# EAGLE design ADSR_duino (EAGLE 9.2.2)
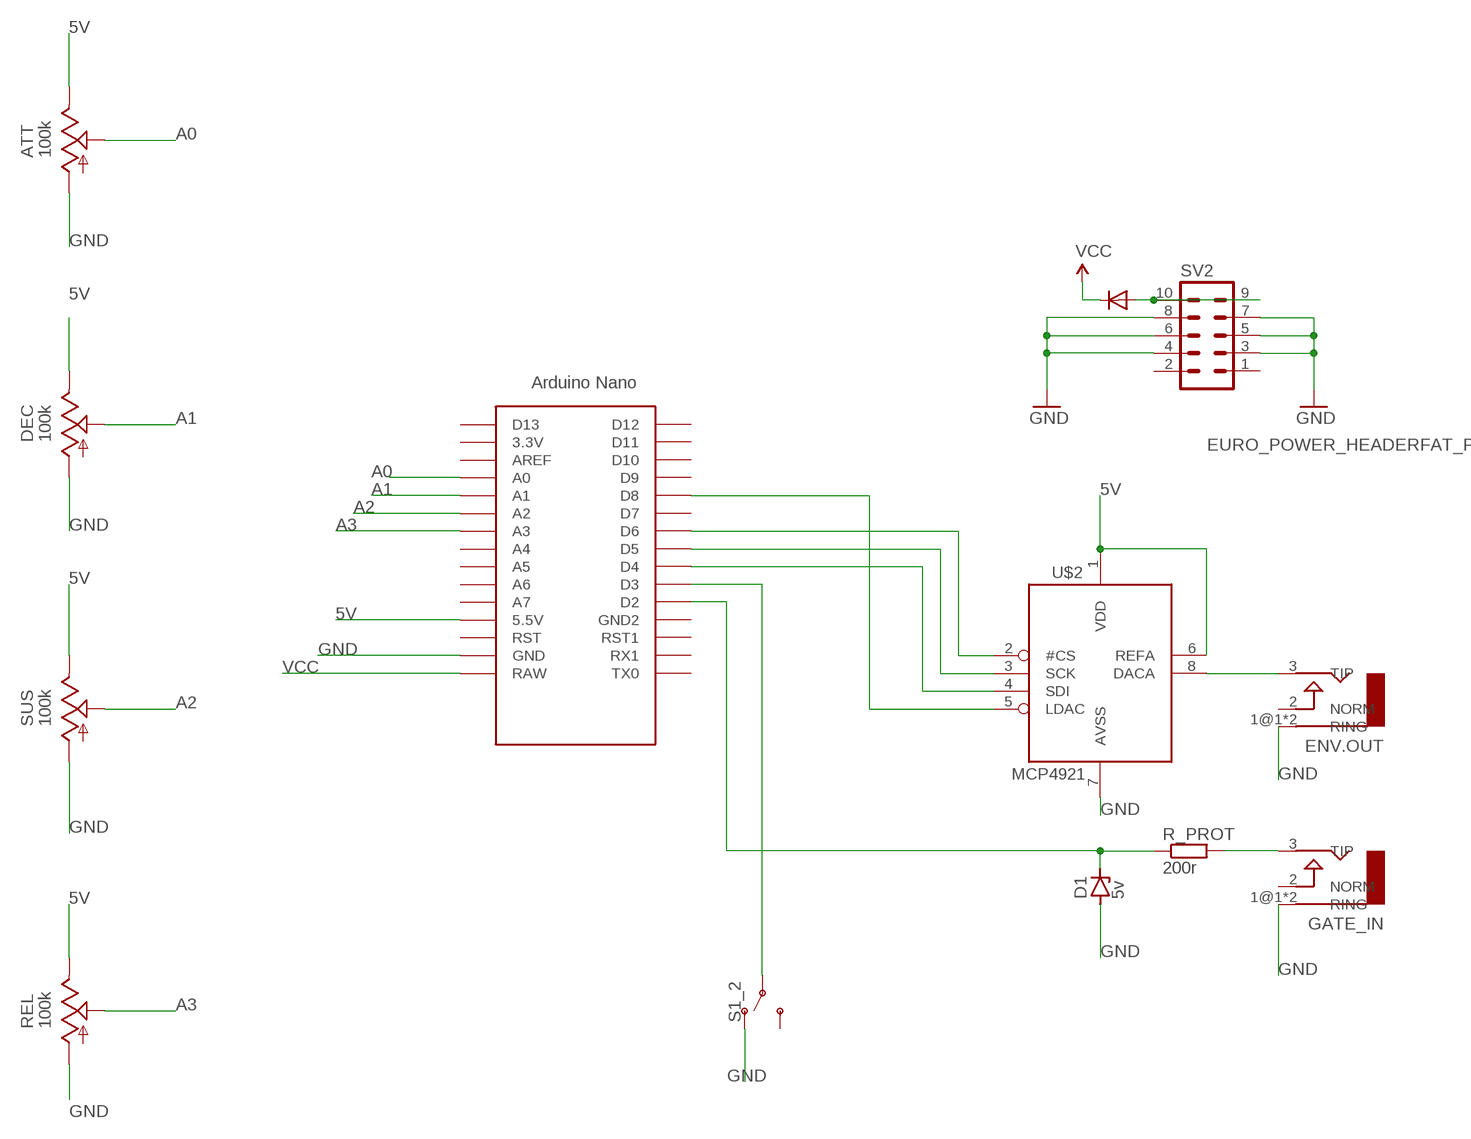
[diagram p0: schematic, sheet 1]

## Parts
ATT  100k  TRIMSLIDE45  [SLIDEPOT-45]
D1  5v  ZENER-DIODEZD-5  [ZDIO-5]
D2  1N5819HW  DIODEDO-1N4148  [DO-1N4148]
DEC  100k  TRIMSLIDE45  [SLIDEPOT-45]
ENV.OUT  AUDIO-JACKERTHENVAR  [ERTHENVAR-JACK]
GATE_IN  AUDIO-JACKERTHENVAR  [ERTHENVAR-JACK]
R_PROT  200r  RESISTOR7MM  [7MM_RESISTOR]
REL  100k  TRIMSLIDE45  [SLIDEPOT-45]
S1_2  SWITCH-SPDT-PTH-11.6X4.0MM  [SWITCH_SPDT_PTH_11.6X4.0MM]
SUS  100k  TRIMSLIDE45  [SLIDEPOT-45]
SV2  EURO_POWER_HEADERFAT_PADS  [EURO_PWR_HEADER_FAT]
U$1  NANO  [NANO]
U$2  MCP4921  [DIL08]

## Nets
5V: ATT.B DEC.B REL.B SUS.B U$1.5V(5.5V) U$2.1(VDD) U$2.6(REFA)
A0: ATT.WIPER U$1.A0
A1: DEC.WIPER U$1.A1
A2: SUS.WIPER U$1.A2
A3: REL.WIPER U$1.A3
GND: ATT.A D1.A DEC.A ENV.OUT.1@1(RING) ENV.OUT.1@2(RING) GATE_IN.1@1(RING) GATE_IN.1@2(RING) REL.A S1_2.1(O) SUS.A SV2.3 SV2.4 SV2.5 SV2.6 SV2.7 SV2.8 U$1.GND U$2.7(AVSS)
N$1: D2.A SV2.9 SV2.10
N$2: S1_2.2(P) U$1.D3
N$3: GATE_IN.3(TIP) R_PROT.2
N$4: ENV.OUT.3(TIP) U$2.8(DACA)
N$5: D1.C R_PROT.1 U$1.D2
N$6: U$1.D4 U$2.4(SDI)
N$7: U$1.D5 U$2.3(SCK)
N$8: U$1.D6 U$2.2(#CS)
N$9: U$1.D8 U$2.5(LDAC)
VCC: D2.C U$1.RAW
Unconnected: ENV.OUT.2(NORM) GATE_IN.2(NORM) S1_2.3(S) SV2.1 SV2.2 U$1.3.3V U$1.A4 U$1.A5 U$1.A6 U$1.A7 U$1.AREF U$1.D7 U$1.D9 U$1.D10 U$1.D11 U$1.D12 U$1.D13 U$1.GND1(GND2) U$1.RST U$1.RST1 U$1.RX1 U$1.TX0

## Library data of the parts
ATT DEC REL SUS = stefan-lochbrunner_EAGLE_master_custom libraries_potentiometers_Bourns PTA series_Bourns PTA series:TRIM: Sliding potentiometers Based on Adafruits (https://github.com/adafruit/Adafruit-Eagle-Library) 'TRIM' device. For Bourns PTA series and TT Electronics PSxx series potentiometers.
D1 = diode:ZENER-DIODE: Z-Diode
D2 = adafruit:DIODE: Diode SMADIODE - SMA Surface Mount Package 20V 1A Schottky Diode Digikey: 641-1014-6-ND DO-1N4148 - Through Hole Small Current Diode SOD-123 20V 1 A (.5mV Vf) Schottky Diode - Digikey: MBRX120TPMSCT-ND SOD-323 10V 570mA (.38mV Vf, 3ns) Schottky Diode - Digikey: ZLLS410CT-ND SOD-523 30V 30mA Schottky Diode (RB751S-40TE61) - Digikey: RB751S-40TE61CT-ND SOT23-R/W - SOT23 Package (R = Solder Paste/Reflow Ovens, W = Hand-Soldering) BAT54Film 40V 300mA - Digikey: 497-7162-1-ND
ENV.OUT GATE_IN = erthenvar:AUDIO-JACK: Switching Mono 3.5mm Audio Jack from Erthenvar.
R_PROT = MusicThingModular:RESISTOR: Standard resistor, various versions
S1_2 = SPDT_Switches_Thonk:SWITCH-SPDT: Single Pole, Double Throw (SPDT) Switch; PROD_ID: SWCH-08261; SF_SKU: COM-00102
SV2 = MusicThingModular:EURO_POWER_HEADER: Power Header 10 pin power header for Eurorack Power Supplies Variants with fatter pads for easier soldering, and the LOCK variant which has 5mil offset pins to hold the component in place before soldering
U$1 = Arduino-clone_EDITED_coordinates:NANO: Arduino Nano
U$2 = adafruit:MCP4921

## Board
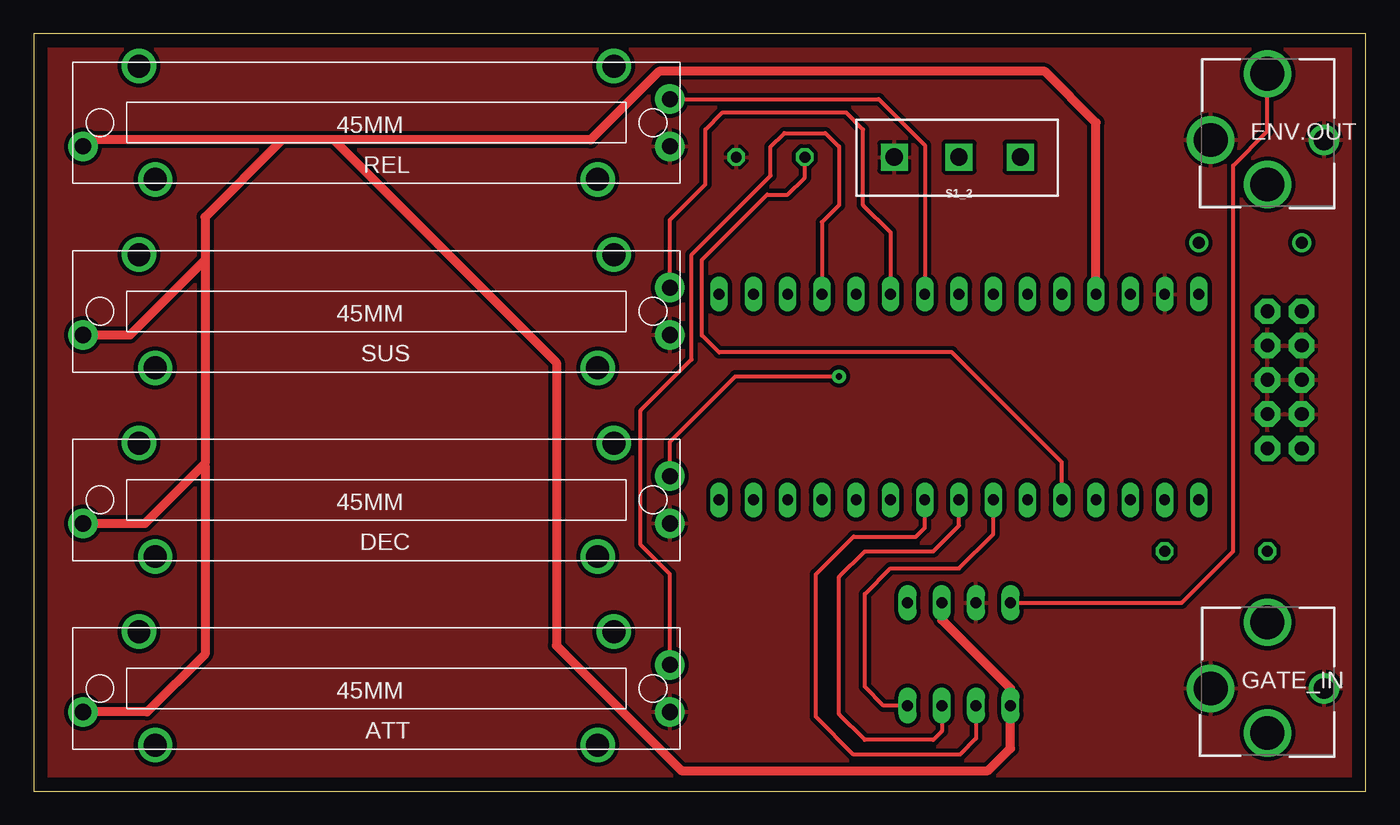
[diagram p1: board, top side]
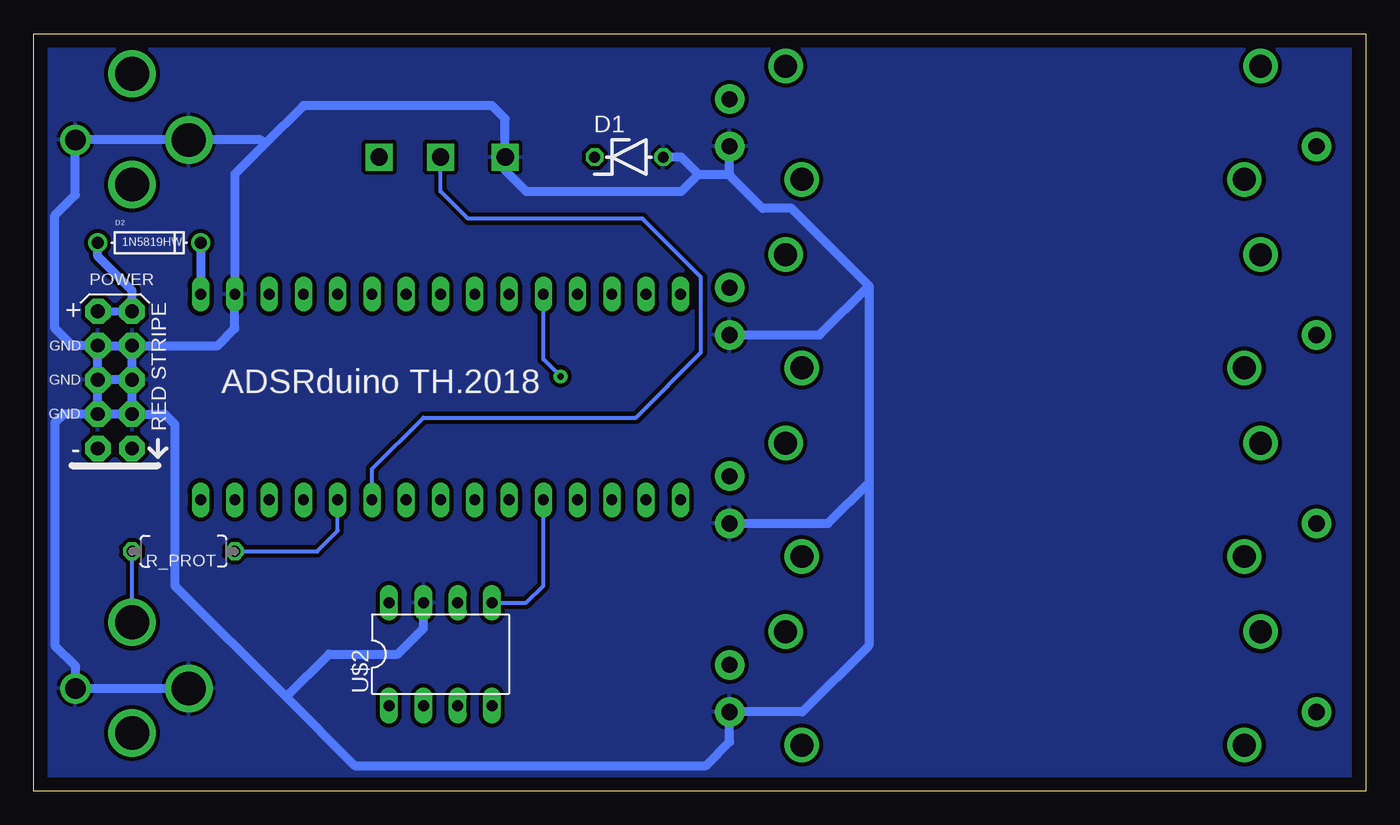
[diagram p2: board, bottom side, seen from below]

Size 98.73 x 56.12 mm. Coordinates in mm from the lower left corner, seen from the top.
Outline: 0,0 98.73,0 98.73,56.12 0,56.12 0,0
Copper layers (1*16): Top 0.035mm / dielectric 1.5mm / Bottom 0.035mm
Design rules "default": minimum track width 6mil, minimum drill 0.35mm, track to track 6mil, track to pad 6mil, pad to pad 6mil, via to via 6mil, smd to smd 6mil, copper to edge 40mil, drill to drill 6mil, minimum pad ring 10mil, minimum via ring 8mil, stop-mask expansion 4mil, vias tented up to drill 0mil, thermal gap 10mil

### Footprints (pad centres in the part's own frame; a part is rotated, then mirrored left to right if it is on the bottom)
SLIDEPOT-45 = drill 1.2 pad 2.184: A -21.75,1.75; B 21.75,1.75; WIPER -21.75,-1.75 | drill 1.7 pad 2.54: P$1 -16.4,4.2; P$2 16.4,4.2; P$3 -17.6,-4.2; P$4 17.6,-4.2
ZDIO-5 = drill 0.813 octagon: A 2.54,0; C -2.54,0
DO-1N4148 = drill 0.9: A -3.81,0; C 3.81,0
ERTHENVAR-JACK = drill 2.5: 1@1 -4.2,0; 2 0,-3.3; 3 0,4.9 | drill 1.5: 1@2 4.2,0
7MM_RESISTOR = drill 0.813 octagon: 1 -3.81,0; 2 3.81,0
SWITCH_SPDT_PTH_11.6X4.0MM = drill 1.27 pad 2 square: 1 0,4.8; 2 0,0; 3 0,-4.54
EURO_PWR_HEADER_FAT = drill 1.016 pad 1.88 octagon: 1 -5.08,-1.27; 2 -5.08,1.27; 3 -2.54,-1.27; 4 -2.54,1.27; 5 0,-1.27; 6 0,1.27; 7 2.54,-1.27; 8 2.54,1.27; 9 5.08,-1.27; 10 5.08,1.27
NANO = drill 0.8 long: 3.3V 0,33.02; 5V 0,7.62; A0 0,27.94; A1 0,25.4; A2 0,22.86; A3 0,20.32; A4 0,17.78; A5 0,15.24; A6 0,12.7; A7 0,10.16; AREF 0,30.48; D2 15.24,10.16; D3 15.24,12.7; D4 15.24,15.24; D5 15.24,17.78; D6 15.24,20.32; D7 15.24,22.86; D8 15.24,25.4; D9 15.24,27.94; D10 15.24,30.48; D11 15.24,33.02; D12 15.24,35.56; D13 0,35.56; GND 0,2.54; GND1 15.24,7.62; RAW 0,0; RST 0,5.08; RST1 15.24,5.08; RX1 15.24,2.54; TX0 15.24,0
DIL08 = drill 0.813 long: 1 -3.81,-3.81; 2 -1.27,-3.81; 3 1.27,-3.81; 4 3.81,-3.81; 5 3.81,3.81; 6 1.27,3.81; 7 -1.27,3.81; 8 -3.81,3.81

### Placement (x,y rotation side)
ATT  25.4,7.62 180 top
D1  54.61,46.99 0 bottom
D2  90.17,40.64 0 bottom
DEC  25.4,21.59 180 top
ENV.OUT  91.44,48.26 0 top
GATE_IN  91.44,7.62 0 top
R_PROT  87.63,17.78 180 bottom
REL  25.4,49.53 180 top
S1_2  68.58,46.99 90 top
SUS  25.4,35.56 180 top
SV2  92.71,30.48 90 bottom
U$1  86.36,36.83 270 bottom
U$2  68.58,10.16 0 bottom

### Tracks (layer width: path | path; a pad name or v marks a point on that pad's centre or on a via)
5V
  Top 0.66: U$1.5V 78.74,49.53 74.93,53.34 46.35,53.34 41.27,48.26 22.23,48.26 | 22.23,48.26 18.41,48.26 | 18.41,48.26 12.7,42.55 12.7,39.37 | ATT.B 8.41,5.87 12.7,10.16 12.7,24.13 | 12.7,39.37 12.7,24.29 8.26,19.84 DEC.B | SUS.B 7.14,33.81 12.7,39.37 | 22.23,48.26 38.73,31.75 38.73,10.79 48.01,1.52 70.74,1.52 72.39,3.17 U$2.1 72.39,7.62 67.31,12.7 U$2.6 | 18.41,48.26 4.13,48.26 REL.B
A0
  Top 0.305: ATT.WIPER 47.15,16.09 44.99,18.25 44.99,28.23 48.77,32 48.77,39.76 54.61,45.6 54.61,47.75 55.63,48.77 58.67,48.77 59.69,47.75 59.69,43.43 58.42,42.16 U$1.A0
A1  (via drill 0.46 pad 1.02)
  Top 0.305: DEC.WIPER 47.15,25.88 52,30.73 v59.69,30.73
  Bottom 0.305: v59.69,30.73 60.96,32 U$1.A1
A2
  Top 0.305: SUS.WIPER 47.15,42.32 49.78,44.96 49.78,49.02 51.05,50.29 60.2,50.29 61.47,49.02 61.47,43.43 63.5,41.4 U$1.A2
A3
  Top 0.305: REL.WIPER 62.64,51.28 66.04,47.88 U$1.A3
GND
  Bottom 0.66: SV2.8 SV2.7 | SV2.5 SV2.7 | SV2.5 SV2.6 | SV2.6 SV2.8 | SV2.3 SV2.5 | SV2.3 SV2.4 | SV2.4 SV2.6 | SV2.7 85.09,33.02 83.82,34.29 U$1.GND 83.82,45.72 81.6,47.94 | SV2.8 95.89,33.02 97.16,34.29 97.16,42.67 95.64,44.19 ENV.OUT.1@2 ENV.OUT.1@1 81.92,48.26 81.6,47.94 | SV2.4 96.52,27.94 97.16,27.3 97.16,10.79 95.64,9.28 GATE_IN.1@2 GATE_IN.1@1 | 81.6,47.94 78.74,50.8 64.77,50.8 63.78,49.81 S1_2.1 63.78,46 62.23,44.45 50.73,44.45 49.46,45.72 | 36.83,37.46 36.83,22.86 | 36.83,22.86 36.83,10.79 41.76,5.87 ATT.A 47.15,3.65 48.9,1.91 74.93,1.91 80.01,6.99 | SUS.A 40.48,33.81 36.84,37.46 36.83,37.46 | DEC.A 39.85,19.84 36.83,22.86 | SV2.3 89.03,27.94 88.27,27.18 88.27,15.24 80.01,6.99 | 80.01,6.99 76.83,10.16 71.75,10.16 69.85,12.06 U$2.7 | 36.83,37.46 42.55,43.18 44.7,43.18 47.15,45.63 47.15,45.72 | 47.15,45.72 REL.A | 49.46,45.72 47.15,45.72 | 49.46,45.72 50.73,46.99 D1.A
  pour Top (isolate 0.305): 0,0 0,55.63 0.25,55.88 98.55,55.88 98.81,55.63 98.81,0
  pour Bottom (isolate 0.305): 0,0 0,55.88 98.81,55.88 98.81,0
N$1
  Bottom 0.61: SV2.10 SV2.9
  Bottom 0.66: SV2.9 91.44,37.08 93.98,39.62 D2.A
N$2
  Bottom 0.305: U$1.D3 73.66,23.88 69.85,27.69 54.1,27.69 49.28,32.51 49.28,38.1 53.59,42.42 66.55,42.42 68.58,44.45 S1_2.2
N$3
  Bottom 0.305: GATE_IN.3 R_PROT.2
N$4
  Top 0.305: U$2.8 85.09,13.97 88.9,17.78 88.9,46.35 91.44,48.9 ENV.OUT.3
N$5
  Top 0.305: U$1.D2 76.2,24.38 68.07,32.51 50.8,32.51 49.53,33.78 49.53,39.37 54.36,44.2 55.88,44.2 57.15,45.47 D1.C
  Bottom 0.305: R_PROT.1 77.72,17.78 76.2,19.3 U$1.D2
N$6
  Top 0.305: U$2.4 62.99,6.35 61.59,7.75 61.59,14.61 63.5,16.51 68.58,16.51 71.12,19.05 U$1.D4
N$7
  Top 0.305: U$2.3 67.31,4.45 66.67,3.81 61.59,3.81 59.69,5.71 59.69,15.88 61.59,17.78 66.67,17.78 68.58,19.68 U$1.D5
N$8
  Top 0.305: U$2.2 69.85,3.91 68.66,2.72 60.77,2.72 57.96,5.53 57.96,16.06 60.77,18.87 65.41,18.87 66.04,19.51 U$1.D6
N$9
  Bottom 0.305: U$2.5 62.23,13.97 60.96,15.24 U$1.D8
VCC
  Bottom 0.66: D2.C U$1.RAW

### Text on the board
bNames: ADSRduino TH.2018